# Altium schematic sheet Clk_recovery.SchDoc: =ProjectName
size 420 x 297 mm; Author: T.P.; CompanyName: WUT; DrawnBy: T.P.; Organization: WUT ISE; Address1: Warsaw Univeristy of Technology; Address2: Nowowiejska 15/19; DocumentNumber: 15; Revision: 0.9; SheetNumber: 15; SheetTotal: 36; EDA_Number: ARTIQ; Projet: ARTIQ/SINARA; ModifiedBy: -; CreateDate: XX/XX/XXXX; CheckedDate: -; Title2: Clk_recovery.SchDoc; DivGrp: ISE; Designer: G.K. and T.P.; ModifiedDate: -; ProjectName: ADC/DAC MEZZANINE
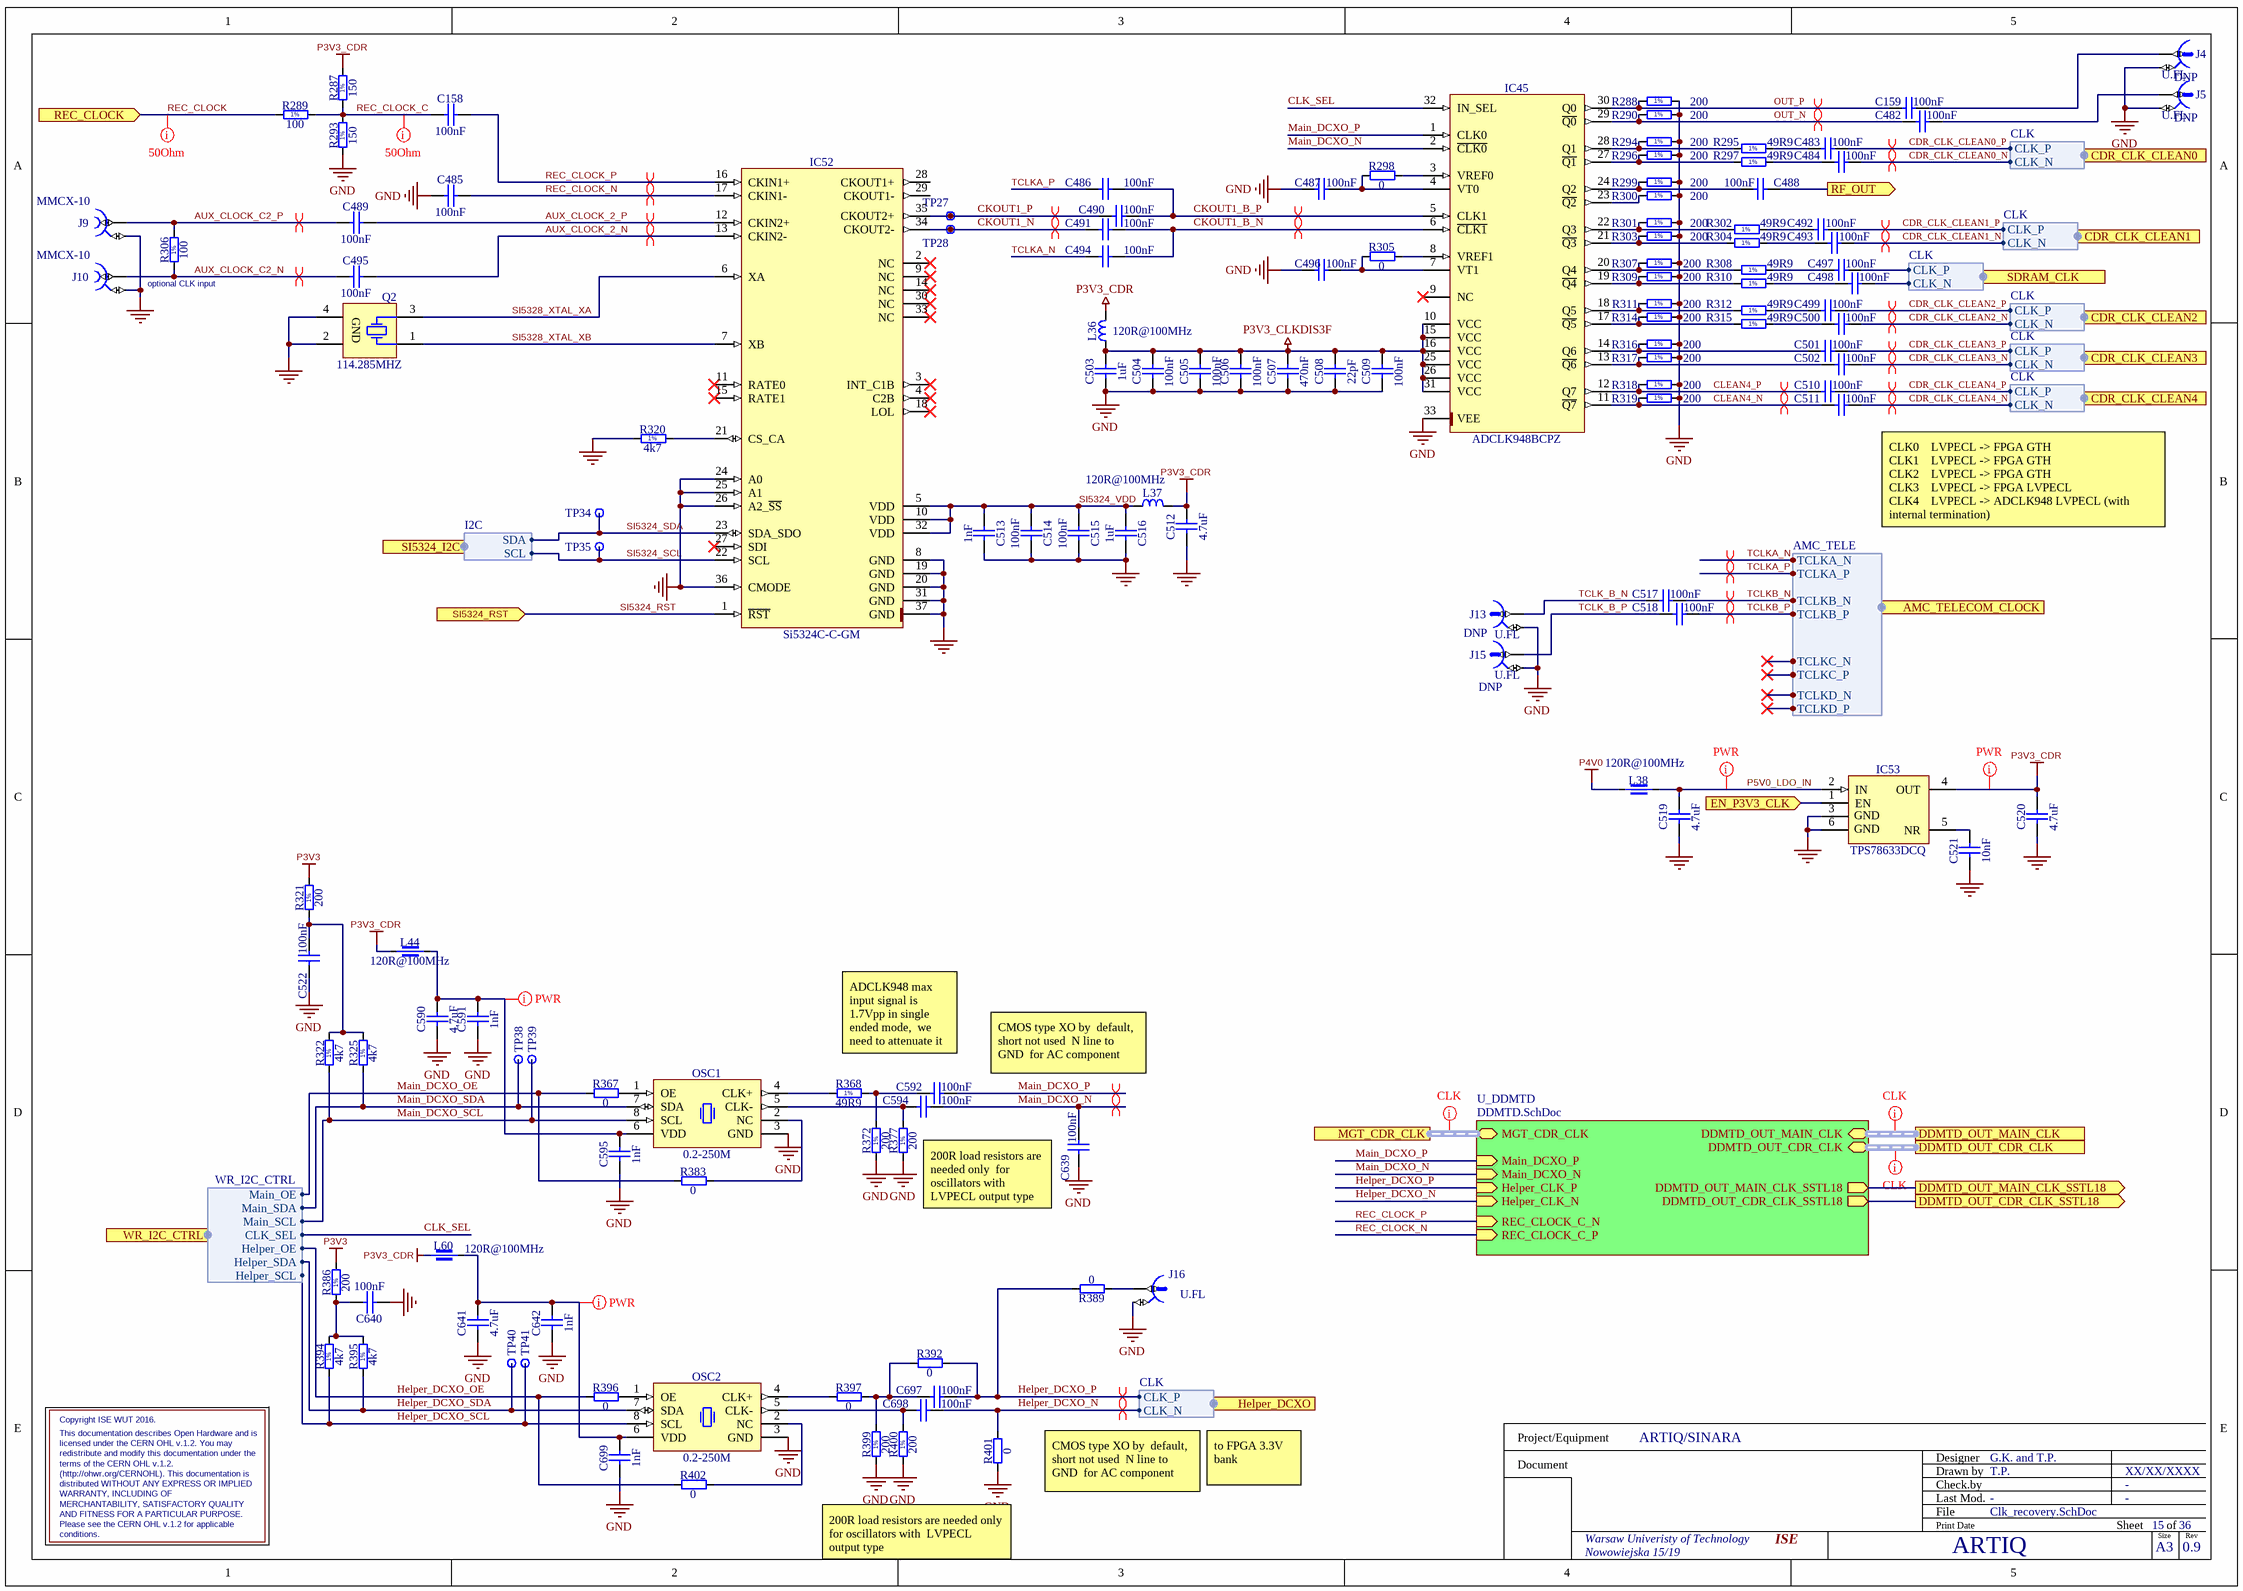
[diagram p0: Clk_recovery.SchDoc]

## Parts
C158  100nF  [CAPC0603X33N]
C159  100nF  [CAPC0603X33N]
C482  100nF  [CAPC0603X33N]
C483  100nF  [CAPC0603X33N]
C484  100nF  [CAPC0603X33N]
C485  100nF  [CAPC0603X33N]
C486  100nF  [CAPC0603X33N]
C487  100nF  [CAPC0603X33N]
C488  100nF  [CAPC0603X33N]
C489  100nF  [CAPC0603X33N]
C490  100nF  [CAPC0603X33N]
C491  100nF  [CAPC0603X33N]
C492  100nF  [CAPC0603X33N]
C493  100nF  [CAPC0603X33N]
C494  100nF  [CAPC0603X33N]
C495  100nF  [CAPC0603X33N]
C496  100nF  [CAPC0603X33N]
C497  100nF  [CAPC0603X33N]
C498  100nF  [CAPC0603X33N]
C499  100nF  [CAPC0603X33N]
C500  100nF  [CAPC0603X33N]
C501  100nF  [CAPC0603X33N]
C502  100nF  [CAPC0603X33N]
C503  1uF  [CAPC1005X55N]
C504  100nF  [CAPC0603X33N]
C505  100nF  [CAPC0603X33N]
C506  100nF  [CAPC0603X33N]
C507  470nF  [CAPC1005X55N]
C508  22pF  [CAPC1005X55N]
C509  100nF  [CAPC0603X33N]
C510  100nF  [CAPC0603X33N]
C511  100nF  [CAPC0603X33N]
C512  4.7uF  [CAPC1608X90N]
C513  1nF  [CAPC0603X33N]
C514  100nF  [CAPC0603X33N]
C515  100nF  [CAPC0603X33N]
C516  1uF  [CAPC1005X55N]
C517  100nF  [CAPC0603X33N]
C518  100nF  [CAPC0603X33N]
C519  4.7uF  [CAPC1608X90N]
C520  4.7uF  [CAPC1608X90N]
C521  10nF  [CAPC1608X87N]
C522  100nF  [CAPC0603X33N]
C590  4.7uF  [CAPC1608X90N]
C591  1nF  [CAPC0603X33N]
C592  100nF  [CAPC0603X33N]
C594  100nF  [CAPC0603X33N]
C595  1nF  [CAPC0603X33N]
C639  100nF  [CAPC0603X33N]
C640  100nF  [CAPC0603X33N]
C641  4.7uF  [CAPC1608X90N]
C642  1nF  [CAPC0603X33N]
C697  100nF  [CAPC0603X33N]
C698  100nF  [CAPC0603X33N]
C699  1nF  [CAPC0603X33N]
IC45  ADCLK948BCPZ  [QFN50P500X500X80-33N-S285]
IC52  Si5324C-C-GM  [QFN50P600X600X90-37N-S425]
IC53  TPS78633DCQ  [SOT127P700X180-6N]
J4  U.FL  value DNP  [HIROSE_U.FL-R-SMT-1(10)]
J5  U.FL  value DNP  [HIROSE_U.FL-R-SMT-1(10)]
J9  Part Number: MMCX-10  [NINIGI_MMCX-10]  (hidden comment: Coax_1Female_1Shield)
J10  Part Number: MMCX-10  [NINIGI_MMCX-10]  (hidden comment: Coax_1Female_1Shield)
J13  U.FL  value DNP  [HIROSE_U.FL-R-SMT-1(10)]
J15  U.FL  value DNP  [HIROSE_U.FL-R-SMT-1(10)]
J16  U.FL  [HIROSE_U.FL-R-SMT-1(10)]
L36  120R@100MHz  [INDC1608X95N]
L37  120R@100MHz  [INDC1608X95N]
L38  120R@100MHz  [INDC1608X95N]
L44  120R@100MHz  [INDC1608X95N]
L60  120R@100MHz  [INDC1608X95N]
OSC1  0.2-250M  [OSC_SILICON-LAB_SI570]
OSC2  0.2-250M  [OSC_SILICON-LAB_SI570]
Q2  114.285MHZ  [XTAL_CONNOR_CS]
R287  150  [RESC1005X40N]
R288  200  [RESC1005X40N]
R289  100  [RESC1005X40N]
R290  200  [RESC1005X40N]
R293  150  [RESC1005X40N]
R294  200  [RESC1005X40N]
R295  49R9  [RESC1005X40N]
R296  200  [RESC1005X40N]
R297  49R9  [RESC1005X40N]
R298  0  [RESC1005X40N]
R299  200  [RESC1005X40N]
R300  200  [RESC1005X40N]
R301  200  [RESC1005X40N]
R302  49R9  [RESC1005X40N]
R303  200  [RESC1005X40N]
R304  49R9  [RESC1005X40N]
R305  0  [RESC1005X40N]
R306  100  [RESC1005X40N]
R307  200  [RESC1005X40N]
R308  49R9  [RESC1005X40N]
R309  200  [RESC1005X40N]
R310  49R9  [RESC1005X40N]
R311  200  [RESC1005X40N]
R312  49R9  [RESC1005X40N]
R314  200  [RESC1005X40N]
R315  49R9  [RESC1005X40N]
R316  200  [RESC1005X40N]
R317  200  [RESC1005X40N]
R318  200  [RESC1005X40N]
R319  200  [RESC1005X40N]
R320  4k7  [RESC1005X40N]
R321  200  [RESC1005X40N]
R322  4k7  [RESC1005X40N]
R325  4k7  [RESC1005X40N]
R367  0  [RESC1005X40N]
R368  49R9  [RESC1005X40N]
R372  200  [RESC1005X40N]
R377  200  [RESC1005X40N]
R383  0  [RESC1005X40N]
R386  200  [RESC1005X40N]
R389  0  [RESC1005X40N]
R392  0  [RESC1005X40N]
R394  4k7  [RESC1005X40N]
R395  4k7  [RESC1005X40N]
R396  0  [RESC1005X40N]
R397  0  [RESC1005X40N]
R399  200  [RESC1005X40N]
R400  200  [RESC1005X40N]
R401  0  [RESC1005X40N]
R402  0  [RESC1005X40N]
TP27  Test Point  [TPS127]  (value not drawn)
TP28  Test Point  [TPS127]  (value not drawn)
TP34  Test Point  [TPS127]  (value not drawn)
TP35  Test Point  [TPS127]  (value not drawn)
TP38  Test Point  [TPS127]  (value not drawn)
TP39  Test Point  [TPS127]  (value not drawn)
TP40  Test Point  [TPS127]  (value not drawn)
TP41  Test Point  [TPS127]  (value not drawn)

## Sub-sheets
U_DDMTD = DDMTD.SchDoc: MGT_CDR_CLK (bidir, harness CLK), DDMTD_OUT_CDR_CLK (bidir, harness CLK), DDMTD_OUT_MAIN_CLK (bidir, harness CLK), Main_DCXO_P (in), Main_DCXO_N (in), Helper_CLK_P (in), Helper_CLK_N (in), REC_CLOCK_C_N (in), REC_CLOCK_C_P (in), DDMTD_OUT_CDR_CLK_SSTL18 (out), DDMTD_OUT_MAIN_CLK_SSTL18 (out)

## Ports
AMC_TELECOM_CLOCK (harness AMC_TELE), CDR_CLK_CLEAN0 (harness CLK), CDR_CLK_CLEAN1 (harness CLK), CDR_CLK_CLEAN2 (harness CLK), CDR_CLK_CLEAN3 (harness CLK), CDR_CLK_CLEAN4 (harness CLK), DDMTD_OUT_CDR_CLK (harness CLK), DDMTD_OUT_CDR_CLK_SSTL18 (out), DDMTD_OUT_MAIN_CLK (harness CLK), DDMTD_OUT_MAIN_CLK_SSTL18 (out), EN_P3V3_CLK (in), Helper_DCXO (harness CLK), MGT_CDR_CLK (harness CLK), REC_CLOCK (in), RF_OUT (out), SDRAM_CLK (harness CLK), SI5324_I2C (harness I2C), SI5324_RST (in), WR_I2C_CTRL (harness WR_I2C_CTRL)

## Harnesses
I2C: SCL, SDA
CLK: CLK_N, CLK_P
WR_I2C_CTRL: Main_OE, Main_SDA, Main_SCL, Helper_OE, Helper_SDA, Helper_SCL, CLK_SEL
AMC_TELE: TCLKA_N, TCLKA_P, TCLKB_N, TCLKB_P, TCLKC_N, TCLKC_P, TCLKD_N, TCLKD_P

## Nets
GND: C485.2 C487.1 C496.1 C503.1 C504.1 C505.1 C506.1 C507.1 C508.1 C509.1 C512.1 C513.1 C514.1 C515.1 C516.2 C519.1 C520.1 C521.1 C522.1 C590.1 C591.1 C595.1 C639.1 C640.1 C641.1 C642.1 C699.1 IC45.33(VEE) IC52.8(GND) IC52.19(GND) IC52.20(GND) IC52.24(A0) IC52.25(A1) IC52.26(A2_~{SS}) IC52.31(GND) IC52.36(CMODE) IC52.37(GND) IC53.3(GND) IC53.6(GND) J4.2 J5.2 J9.2 J10.2 J13.2 J15.2 J16.2 OSC1.3(GND) OSC2.3(GND) Q2.2(GND) Q2.4(GND) R288.2 R290.2 R293.1 R294.2 R296.2 R299.2 R300.2 R301.2 R303.2 R307.2 R309.2 R311.2 R314.2 R316.2 R317.2 R318.2 R319.2 R320.1 R372.1 R377.1 R399.1 R400.1 R401.1
P3V3: R321.2 R386.2
P3V3_CDR: C512.2 C520.2 IC53.4(OUT) L36.2 L37.1 L44.1 L60.1 R287.2
P3V3_CLKDIS3F: C503.2 C504.2 C505.2 C506.2 C507.2 C508.2 C509.2 IC45.10(VCC) IC45.15(VCC) IC45.16(VCC) IC45.25(VCC) IC45.26(VCC) IC45.31(VCC) L36.1
P4V0: L38.1
AUX_CLOCK_2_N: C495.1 IC52.13(CKIN2-)
AUX_CLOCK_2_P: C489.1 IC52.12(CKIN2+)
AUX_CLOCK_C2_N: C495.2 J10.1 R306.1
AUX_CLOCK_C2_P: C489.2 J9.1 R306.2
CDR_CLK_CLEAN0_N: C484.1 ; port CDR_CLK_CLEAN0.CLK_N
CDR_CLK_CLEAN0_P: C483.1 ; port CDR_CLK_CLEAN0.CLK_P
CDR_CLK_CLEAN1_N: C493.1 ; port CDR_CLK_CLEAN1.CLK_N
CDR_CLK_CLEAN1_P: C492.1 ; port CDR_CLK_CLEAN1.CLK_P
CDR_CLK_CLEAN2_N: C500.1 ; port CDR_CLK_CLEAN2.CLK_N
CDR_CLK_CLEAN2_P: C499.1 ; port CDR_CLK_CLEAN2.CLK_P
CDR_CLK_CLEAN3_N: C502.1 ; port CDR_CLK_CLEAN3.CLK_N
CDR_CLK_CLEAN3_P: C501.1 ; port CDR_CLK_CLEAN3.CLK_P
CDR_CLK_CLEAN4_N: C511.1 ; port CDR_CLK_CLEAN4.CLK_N
CDR_CLK_CLEAN4_P: C510.1 ; port CDR_CLK_CLEAN4.CLK_P
CKOUT1_B_N: C491.2 C494.2 IC45.6(~{CLK1})
CKOUT1_B_P: C486.2 C490.2 IC45.5(CLK1)
CKOUT1_N: C491.1 IC52.34(CKOUT2-) TP28.1
CKOUT1_P: C490.1 IC52.35(CKOUT2+) TP27.1
CLEAN4_N: C511.2 IC45.11(~{Q7}) R319.1
CLEAN4_P: C510.2 IC45.12(Q7) R318.1
CLK_SEL: IC45.32(IN_SEL) ; port WR_I2C_CTRL.CLK_SEL
DDMTD_OUT_CDR_CLK_SSTL18: port DDMTD_OUT_CDR_CLK_SSTL18, sheet U_DDMTD/DDMTD_OUT_CDR_CLK_SSTL18
DDMTD_OUT_MAIN_CLK_SSTL18: port DDMTD_OUT_MAIN_CLK_SSTL18, sheet U_DDMTD/DDMTD_OUT_MAIN_CLK_SSTL18
EN_P3V3_CLK: IC53.1(EN) ; port EN_P3V3_CLK
Helper_DCXO_N: C698.2 R401.2 ; sheet U_DDMTD/Helper_CLK_N, port Helper_DCXO.CLK_N
Helper_DCXO_OE: R396.1 R402.1 ; port WR_I2C_CTRL.Helper_OE
Helper_DCXO_P: C697.2 R389.2 R392.2 ; sheet U_DDMTD/Helper_CLK_P, port Helper_DCXO.CLK_P
Helper_DCXO_SCL: OSC2.8(SCL) R394.1 TP41.1 ; port WR_I2C_CTRL.Helper_SCL
Helper_DCXO_SDA: OSC2.7(SDA) R395.1 TP40.1 ; port WR_I2C_CTRL.Helper_SDA
Main_DCXO_N: C594.2 C639.2 IC45.2(~{CLK0}) ; sheet U_DDMTD/Main_DCXO_N
Main_DCXO_OE: R367.1 R383.1 ; port WR_I2C_CTRL.Main_OE
Main_DCXO_P: C592.2 IC45.1(CLK0) ; sheet U_DDMTD/Main_DCXO_P
Main_DCXO_SCL: OSC1.8(SCL) R322.1 TP39.1 ; port WR_I2C_CTRL.Main_SCL
Main_DCXO_SDA: OSC1.7(SDA) R325.1 TP38.1 ; port WR_I2C_CTRL.Main_SDA
OUT_N: C482.2 IC45.29(~{Q0}) R290.1
OUT_P: C159.2 IC45.30(Q0) R288.1
P5V0_LDO_IN: C519.2 IC53.2(IN) L38.2
REC_CLOCK: R289.1 ; port REC_CLOCK
REC_CLOCK_C: C158.2 R287.1 R289.2 R293.2
REC_CLOCK_N: C485.1 IC52.17(CKIN1-) ; sheet U_DDMTD/REC_CLOCK_C_P
REC_CLOCK_P: C158.1 IC52.16(CKIN1+) ; sheet U_DDMTD/REC_CLOCK_C_N
RF_OUT: C488.2 ; port RF_OUT
SI5324_RST: IC52.1(~{RST}) ; port SI5324_RST
SI5324_SCL: IC52.22(SCL) TP35.1 ; port SI5324_I2C.SCL
SI5324_SDA: IC52.23(SDA_SDO) TP34.1 ; port SI5324_I2C.SDA
SI5324_VDD: C513.2 C514.2 C515.2 C516.1 IC52.5(VDD) IC52.10(VDD) IC52.32(VDD) L37.2
SI5328_XTAL_XA: IC52.6(XA) Q2.3(X)
SI5328_XTAL_XB: IC52.7(XB) Q2.1(X)
TCLK_B_N: C517.2 J13.1
TCLK_B_P: C518.2 J15.1
TCLKA_N: C494.1 ; port AMC_TELECOM_CLOCK.TCLKA_N
TCLKA_P: C486.1 ; port AMC_TELECOM_CLOCK.TCLKA_P
TCLKB_N: C517.1 ; port AMC_TELECOM_CLOCK.TCLKB_N
TCLKB_P: C518.1 ; port AMC_TELECOM_CLOCK.TCLKB_P
NetC159_1: C159.1 J4.1
NetC482_1: C482.1 J5.1
NetC483_2: C483.2 R295.2
NetC484_2: C484.2 R297.2
NetC487_2: C487.2 IC45.4(VT0) R298.1
NetC488_1: C488.1 IC45.24(Q2) R299.1
NetC492_2: C492.2 R302.2
NetC493_2: C493.2 R304.2
NetC496_2: C496.2 IC45.7(VT1) R305.1
NetC497_1: C497.1 ; port SDRAM_CLK.CLK_P
NetC497_2: C497.2 R308.2
NetC498_1: C498.1 ; port SDRAM_CLK.CLK_N
NetC498_2: C498.2 R310.2
NetC499_2: C499.2 R312.2
NetC500_2: C500.2 R315.2
NetC501_2: C501.2 IC45.14(Q6) R316.1
NetC502_2: C502.2 IC45.13(~{Q6}) R317.1
NetC521_2: C521.2 IC53.5(NR)
NetC522_2: C522.2 R321.1 R322.2 R325.2
NetC590_2: C590.2 C591.2 C595.2 L44.2 OSC1.6(VDD)
NetC592_1: C592.1 R368.2 R372.2
NetC594_1: C594.1 OSC1.5(CLK-) R377.2
NetC640_2: C640.2 R386.1 R394.2 R395.2
NetC641_2: C641.2 C642.2 C699.2 L60.2 OSC2.6(VDD)
NetC697_1: C697.1 R392.1 R397.2 R399.2
NetC698_1: C698.1 OSC2.5(CLK-) R400.2
NetIC45_3: IC45.3(VREF0) R298.2
NetIC45_8: IC45.8(VREF1) R305.2
NetIC45_17: IC45.17(~{Q5}) R314.1 R315.1
NetIC45_18: IC45.18(Q5) R311.1 R312.1
NetIC45_19: IC45.19(~{Q4}) R309.1 R310.1
NetIC45_20: IC45.20(Q4) R307.1 R308.1
NetIC45_21: IC45.21(~{Q3}) R303.1 R304.1
NetIC45_22: IC45.22(Q3) R301.1 R302.1
NetIC45_23: IC45.23(~{Q2}) R300.1
NetIC45_27: IC45.27(~{Q1}) R296.1 R297.1
NetIC45_28: IC45.28(Q1) R294.1 R295.1
NetIC52_21: IC52.21(CS_CA) R320.2
NetJ16_1: J16.1 R389.1
NetOSC1_1: OSC1.1(OE) R367.2
NetOSC1_2: OSC1.2(NC) R383.2
NetOSC1_4: OSC1.4(CLK+) R368.1
NetOSC2_1: OSC2.1(OE) R396.2
NetOSC2_2: OSC2.2(NC) R402.2
NetOSC2_4: OSC2.4(CLK+) R397.1

Not connected (* = marked no-connect by the designer): IC45 9(NC)*; IC52 2(NC)* 3(INT_C1B)* 4(C2B)* 9(NC)* 11(RATE0)* 14(NC)* 15(RATE1)* 18(LOL)* 27(SDI)* 28(CKOUT1+) 29(CKOUT1-) 30(NC)* 33(NC)*

## Buses and harness runs
harness port DDMTD_OUT_CDR_CLK = sheet U_DDMTD/DDMTD_OUT_CDR_CLK
harness port DDMTD_OUT_MAIN_CLK = sheet U_DDMTD/DDMTD_OUT_MAIN_CLK
harness port MGT_CDR_CLK = sheet U_DDMTD/MGT_CDR_CLK

## Layout directives
differential pair; differential pair class Diff_100Ohm: AUX_CLOCK_2_N, AUX_CLOCK_2_P, AUX_CLOCK_C2_N, AUX_CLOCK_C2_P, CKOUT1_B_N, CKOUT1_B_P, CKOUT1_N, CKOUT1_P, Helper_DCXO_N, Helper_DCXO_P, Main_DCXO_N, Main_DCXO_P, REC_CLOCK_N, REC_CLOCK_P, TCLKA_N, TCLKA_P, TCLKB_N, TCLKB_P
differential pair; differential pair class LVPECL: CDR_CLK_CLEAN0_N, CDR_CLK_CLEAN0_P, CDR_CLK_CLEAN1_N, CDR_CLK_CLEAN1_P, CDR_CLK_CLEAN2_N, CDR_CLK_CLEAN2_P, CDR_CLK_CLEAN3_N, CDR_CLK_CLEAN3_P, CDR_CLK_CLEAN4_N, CDR_CLK_CLEAN4_P, CLEAN4_N, CLEAN4_P, OUT_N, OUT_P
mark named 50Ohm: REC_CLOCK, REC_CLOCK_C
net class PWR: NetC590_2, NetC641_2, P3V3_CDR, P5V0_LDO_IN
net class CLK: (no net found under the mark)

## Notes on the sheet
- (near R306) optional CLK input
- CLK0    LVPECL -> FPGA GTH
  CLK1    LVPECL -> FPGA GTH
  CLK2    LVPECL -> FPGA GTH
  CLK3    LVPECL -> FPGA LVPECL
  CLK4    LVPECL -> ADCLK948 LVPECL (with internal termination)
- ADCLK948 max input signal is 1.7Vpp in single  ended mode,  we need to attenuate it
- CMOS type XO by  default, short not used  N line to GND  for AC component
- 200R load resistors are needed only  for oscillators with  LVPECL output type
- Copyright ISE WUT 2016.
- (http://ohwr.org/CERNOHL). This documentation is
- terms of the CERN OHL v.1.2.
- redistribute and modify this documentation under the
- distributed WITHOUT ANY EXPRESS OR IMPLIED
- This documentation describes Open Hardware and is
- licensed under the CERN OHL v.1.2. You may
- to FPGA 3.3V bank
- MERCHANTABILITY, SATISFACTORY QUALITY
- conditions.
- AND FITNESS FOR A PARTICULAR PURPOSE.
- Please see the CERN OHL v.1.2 for applicable
- WARRANTY, INCLUDING OF
- (near R401) CMOS type XO by  default, short not used  N line to GND  for AC component
- Project/Equipment
- Document
- Designer
- Drawn by
- Check.by
- File
- Last Mod.
- Print Date
- Sheet
- Size
- A3
- of
- Rev
- (in symbol R0402_4K7_1%_0.0625W_100PPM) 1%
- (in symbol R0402_49R9_1%_0.0625W_100PPM) 1%
- (in symbol R0402_100R_1%_0.0625W_100PPM) 1%
- (in symbol R0402_150R_1%_0.0625W_100PPM) 1%
- (in symbol R0402_200R_1%_0.0625W_100PPM) 1%

## Library data of the parts
C158 C159 C482-C485 C488 C489 C492 C493 C495 C497-C502 C510 C511 C514 C515 C517 C518 C640 = CC0201_100NF_6.3V_10%_X5R: Non-polarised capacitor; Manufacturer: GENERIC; Part Description: SMD Multilayer Chip Ceramic Capacitor; Manufacturer1 Part Number: 02016D104KAT2A; Tolerance: ±10%; Voltage: 6.3V; TC: X5R; Manufacturer Part Number: CC0201_100NF_6.3V_10%_X5R; Part Number: CC0201_100NF_6.3V_10%_X5R; Value: 100nF; Component Kind: Standard; Component Type: Standard; Pin Count: 2; Status: Not Recommended; Case: 0201; Mounted: Yes; Socket: No; SMD: Yes; Sense: No; Manufacturer1 Example: AVX; Manufacturer1 ComponentHeight: 0.33mm; HelpURL: \\cern.ch\dfs\Applications\Altium\Datasheets\CC0201_X5R_AVX.pdf; Author: CERN DEM JLC; CreateDate: 03.12.2007; LatestRevisionDate: 03.12.2007
C486 C487 C490 C491 C494 C496 C504-C506 C509 C522 C592 C594 C639 C697 C698 = CC0201_100NF_6.3V_10%_X5R: Non-polarised capacitor; Part Description: SMD Multilayer Chip Ceramic Capacitor; Manufacturer: GENERIC; Manufacturer1 Part Number: 02016D104KAT2A; Voltage: 6.3V; TC: X5R; Tolerance: ±10%; Part Number: CC0201_100NF_6.3V_10%_X5R; Component Kind: Standard; Component Type: Standard; Pin Count: 2; Value: 100nF; Status: Not Recommended; Manufacturer Part Number: CC0201_100NF_6.3V_10%_X5R; Case: 0201; Mounted: Yes; Socket: No; SMD: Yes; Sense: No; Manufacturer1 Example: AVX; Manufacturer1 ComponentHeight: 0.33mm; HelpURL: \\cern.ch\dfs\Applications\Altium\Datasheets\CC0201_X5R_AVX.pdf; Author: CERN DEM JLC; CreateDate: 03.12.2007; LatestRevisionDate: 03.12.2007
C503 = CC0402_1UF_16V_10%_X5R: Non-polarised capacitor; Part Description: SMD Multilayer Chip Ceramic Capacitor; Manufacturer: GENERIC; Manufacturer1 Part Number: C1005X5R1C105KT; Voltage: 16V; TC: X5R; Tolerance: ±10%; Part Number: CC0402_1UF_16V_10%_X5R; Component Kind: Standard; Component Type: Standard; Pin Count: 2; Value: 1uF; Status: Preferred; Manufacturer Part Number: CC0402_1UF_16V_10%_X5R; Case: 0402; Mounted: Yes; Socket: No; SMD: Yes; Sense: No; Manufacturer1 Example: TDK; Manufacturer1 ComponentHeight: 0.55mm; HelpURL: \\cern.ch\dfs\Applications\Altium\Datasheets\CC0402_X5R_TDK_C.pdf; Author: CERN DEM JLC; CreateDate: 25.10.2012; LatestRevisionDate: 25.10.2012
C507 = CC0402_470NF_16V_10%_X5R: Non-polarised capacitor; Part Description: SMD Multilayer Chip Ceramic Capacitor; Manufacturer: GENERIC; Manufacturer1 Part Number: C1005X5R1C105KT; Voltage: 16V; TC: X5R; Tolerance: ±10%; Part Number: CC0402_470NF_16V_10%_X5R; Component Kind: Standard; Component Type: Standard; Pin Count: 2; Value: 470nF; Status: Preferred; Manufacturer Part Number: CC0402_470NF_16V_10%_X5R; Case: 0402; Mounted: Yes; Socket: No; SMD: Yes; Sense: No; Manufacturer1 Example: TDK; Manufacturer1 ComponentHeight: 0.55mm; HelpURL: \\cern.ch\dfs\Applications\Altium\Datasheets\CC0402_X5R_TDK_C.pdf; Author: CERN DEM JLC; CreateDate: 25.10.2012; LatestRevisionDate: 25.10.2012
C508 = CC0402_22PF_50V_5%_C0G: Non-polarised capacitor; Part Description: SMD Multilayer Chip Ceramic Capacitor; Manufacturer: GENERIC; Manufacturer1 Part Number: C0402C220J5GACTU; Voltage: 50V; TC: C0G/NP0; Tolerance: ±5%; Part Number: CC0402_22PF_50V_5%_C0G; Component Kind: Standard; Component Type: Standard; Pin Count: 2; Value: 22pF; Status: Preferred; Manufacturer Part Number: CC0402_22PF_50V_5%_C0G; Case: 0402; Mounted: Yes; Socket: No; SMD: Yes; Sense: No; Manufacturer1 Example: KEMET; Manufacturer1 ComponentHeight: 0.55mm; HelpURL: \\cern.ch\dfs\Applications\Altium\Datasheets\CC0805_C0G_KEMET_(Commercial Grade).pdf; Author: CERN DEM JLC; CreateDate: 03.12.2007; LatestRevisionDate: 03.12.2007
C512 C519 C520 = CC0603_4.7UF_25V_10%_X5R: Non-polarised capacitor; Manufacturer: GENERIC; Part Description: SMD Multilayer Chip Ceramic Capacitor; Manufacturer1 Part Number: GRM188R61E475KE11D; Tolerance: ±10%; Voltage: 25V; TC: X5R; Manufacturer Part Number: CC0603_4.7UF_25V_10%_X5R; Part Number: CC0603_4.7UF_25V_10%_X5R; Value: 4.7uF; Component Kind: Standard; Component Type: Standard; Pin Count: 2; Status: None; Case: 0603; Mounted: Yes; Socket: No; SMD: Yes; Sense: No; Manufacturer1 Example: MURATA; Manufacturer1 ComponentHeight: 0.95mm; HelpURL: \\cern.ch\dfs\Applications\Altium\Datasheets\CC0603_MURATA_GRM188R61E475KE11D.pdf; Author: CERN DEM JLC; CreateDate: 10.11.2014; LatestRevisionDate: 10.11.2014
C513 = CC0201_1NF_16V_10%_X5R: Non-polarised capacitor; Manufacturer: GENERIC; Part Description: SMD Multilayer Chip Ceramic Capacitor; Manufacturer1 Part Number: 0201YD102KAT2A; Tolerance: ±10%; Voltage: 16V; TC: X5R; Manufacturer Part Number: CC0201_1NF_16V_10%_X5R; Part Number: CC0201_1NF_16V_10%_X5R; Value: 1nF; Component Kind: Standard; Component Type: Standard; Pin Count: 2; Status: Not Recommended; Case: 0201; Mounted: Yes; Socket: No; SMD: Yes; Sense: No; Manufacturer1 Example: AVX; Manufacturer1 ComponentHeight: 0.33mm; HelpURL: \\cern.ch\dfs\Applications\Altium\Datasheets\CC0201_X5R_AVX.pdf; Author: CERN DEM JLC; CreateDate: 03.12.2007; LatestRevisionDate: 03.12.2007
C516 = CC0402_1UF_16V_10%_X5R: Non-polarised capacitor; Manufacturer: GENERIC; Part Description: SMD Multilayer Chip Ceramic Capacitor; Manufacturer1 Part Number: C1005X5R1C105KT; Tolerance: ±10%; Voltage: 16V; TC: X5R; Manufacturer Part Number: CC0402_1UF_16V_10%_X5R; Part Number: CC0402_1UF_16V_10%_X5R; Value: 1uF; Component Kind: Standard; Component Type: Standard; Pin Count: 2; Status: Preferred; Case: 0402; Mounted: Yes; Socket: No; SMD: Yes; Sense: No; Manufacturer1 Example: TDK; Manufacturer1 ComponentHeight: 0.55mm; HelpURL: \\cern.ch\dfs\Applications\Altium\Datasheets\CC0402_X5R_TDK_C.pdf; Author: CERN DEM JLC; CreateDate: 25.10.2012; LatestRevisionDate: 25.10.2012
C521 = CC0603_10NF_50V_5%_C0G: Non-polarised capacitor; Part Description: SMD Multilayer Chip Ceramic Capacitor; Manufacturer: GENERIC; Manufacturer1 Part Number: C1608C0G1H103J080AA; Voltage: 50V; TC: C0G/NP0; Tolerance: ±5%; Part Number: CC0603_10NF_50V_5%_C0G; Component Kind: Standard; Component Type: Standard; Pin Count: 2; Value: 10nF; Status: Preferred; Manufacturer Part Number: CC0603_10NF_50V_5%_C0G; Case: 0603; Mounted: Yes; Socket: No; SMD: Yes; Sense: No; Manufacturer1 Example: TDK; Manufacturer1 ComponentHeight: 0.9mm; HelpURL: \\cern.ch\dfs\Applications\Altium\Datasheets\CC0603_C0G_TDK_C.pdf; Author: CERN DEM JLC; CreateDate: 10.12.2014; LatestRevisionDate: 10.12.2014
C590 C641 = CC0603_4.7UF_25V_10%_X5R: Non-polarised capacitor; Part Description: SMD Multilayer Chip Ceramic Capacitor; Manufacturer: GENERIC; Manufacturer1 Part Number: GRM188R61E475KE11D; Voltage: 25V; TC: X5R; Tolerance: ±10%; Part Number: CC0603_4.7UF_25V_10%_X5R; Component Kind: Standard; Component Type: Standard; Pin Count: 2; Value: 4.7uF; Status: None; Manufacturer Part Number: CC0603_4.7UF_25V_10%_X5R; Case: 0603; Mounted: Yes; Socket: No; SMD: Yes; Sense: No; Manufacturer1 Example: MURATA; Manufacturer1 ComponentHeight: 0.95mm; HelpURL: \\cern.ch\dfs\Applications\Altium\Datasheets\CC0603_MURATA_GRM188R61E475KE11D.pdf; Author: CERN DEM JLC; CreateDate: 10.11.2014; LatestRevisionDate: 10.11.2014
C591 C595 C642 C699 = CC0201_1NF_16V_10%_X5R: Non-polarised capacitor; Part Description: SMD Multilayer Chip Ceramic Capacitor; Manufacturer: GENERIC; Manufacturer1 Part Number: 0201YD102KAT2A; Voltage: 16V; TC: X5R; Tolerance: ±10%; Part Number: CC0201_1NF_16V_10%_X5R; Component Kind: Standard; Component Type: Standard; Pin Count: 2; Value: 1nF; Status: Not Recommended; Manufacturer Part Number: CC0201_1NF_16V_10%_X5R; Case: 0201; Mounted: Yes; Socket: No; SMD: Yes; Sense: No; Manufacturer1 Example: AVX; Manufacturer1 ComponentHeight: 0.33mm; HelpURL: \\cern.ch\dfs\Applications\Altium\Datasheets\CC0201_X5R_AVX.pdf; Author: CERN DEM JLC; CreateDate: 03.12.2007; LatestRevisionDate: 03.12.2007
IC45 = ADCLK948BCPZ: Two Selectable Inputs, 8 LVPECL Outputs, SiGe Clock Fanout Buffer; Manufacturer: ANALOG DEVICES; PressFit: No; Bonding: No; Part Number: ADCLK948BCPZ; Component Kind: Standard; Component Type: Standard; Device: ADCLK948BCPZ; PackageDescription: QFN, 0.50mm Pitch, Square; 8 Pin X 8 Pin, 5mm X 5mm X 1.00mm H body (w/thermal tab 2.85 X 2.85mm),  IPC Medium Density; Part Description: Two Selectable Inputs, 8 LVPECL Outputs, SiGe Clock Fanout Buffer; Manufacturer Part Number: ADCLK948BCPZ; Pin Count: 33; Case: QFN32; Mounted: Yes; Socket: No; SMD: Yes; Sense: No; ComponentHeight: 0.8mm; Author: CERN DEM MR; HelpURL: \\cern.ch\dfs\Applications\Altium\Datasheets\ADCLK948BCPZ.pdf; CreateDate: 30.11.2016; LatestRevisionDate: 30.11.2016
IC52 = Si5324C-C-GM: Any Frequency Precision Clock Multiplier/Jitter Attenuator; Manufacturer: SILICON LABS; PressFit: No; Bonding: No; Manufacturer Part Number: Si5324C-C-GM; PackageDescription: QFN, 0.50mm Pitch, Square; 36 Pin, 6.00mm L X 6.00mm W X 0.90mm H Body (w/thermal tab 4.25mm x 4.25mm), IPC Medium Density; Part Description: Any Frequency Precision Clock Multiplier/Jitter Attenuator; Part Number: Si5324C-C-GM; Component Kind: Standard; Component Type: Standard; Device: Si5324C-C-GM; Pin Count: 37; Case: QFN36; Mounted: Yes; Socket: No; SMD: Yes; Sense: No; ComponentHeight: 0.9mm; HelpURL: \\cern.ch\dfs\Applications\Altium\Datasheets\Si5324C-C-GM.pdf; Author: CERN DEM JLC; CreateDate: 19.08.2013; LatestRevisionDate: 19.08.2013
IC53 = TPS78633DCQ: Ultralow-Noise, High-PSRR, Fast, RF, 1.5A Low-Dropout Linear Regulator; Part Description: 3.3V Ultralow-Noise, High-PSRR, Fast, RF, 1.5A Low-Dropout Linear Regulator; Manufacturer: TEXAS INSTRUMENTS; PressFit: No; Bonding: No; Part Number: TPS78633DCQ; Component Kind: Standard; Component Type: Standard; Device: TPS78633DCQ; PackageDescription: SOT223, 6-Leads, Body 6.6x7.3mm (max), Pitch 1.27mm, IPC Medium Density; Manufacturer Part Number: TPS78633DCQ; Pin Count: 6; Case: SOT223; Mounted: Yes; Socket: No; SMD: Yes; Sense: No; ComponentHeight: 1.8mm; HelpURL: \\cern.ch\dfs\Applications\Altium\Datasheets\TPS78633DCQ.pdf; Author: CERN DEM JMW; CreateDate: 07.10.2008; LatestRevisionDate: 13.02.2017
J4 J5 J13 J15 = HIROSE_U.FL-R-SMT-1(10): Part Description: Up to 6GHz Ultra Small Surface Mount Male Coaxial Connectors U.FL Series; Manufacturer: HIROSE (HRS); Mounted: No; PressFit: No; Part Number: HIROSE_U.FL-R-SMT-1(10); Component Kind: Standard; Component Type: Standard; Pin Count: 2; Family: U.FL; Socket: No; SMD: Yes; Sense: No; Status: None; Manufacturer Part Number: U.FL-R-SMT-1(10); ComponentHeight: 1.25mm; HelpURL: \\cern.ch\dfs\Applications\Altium\Datasheets\HIROSE_U.FL-R-SMT-1(10).pdf; Author: CERN DEM JLC; CreateDate: 24.03.2010; LatestRevisionDate: 24.03.2010
J9 J10 = CON_RF_MMCX: Part Description: Straight Through-hole 50 Ohm Micro Mini RF Jack, MMCX Series; Manufacturer: NINIGI; Manufacturer Part Number: NINIGI MMCX-10; PressFit: No; Component Kind: Standard; Component Type: Standard; Pin Count: 2; Mounted: Yes; Socket: No; Sense: No; SMD: No; Status: None; ComponentHeight: 4.35mm; HelpURL: \\cern.ch\dfs\Applications\Altium\Datasheets\SAMTEC_MMCX-J-P-H-ST-TH1.pdf; Author: GK; CreateDate: 05.12.2012; LatestRevisionDate: 05.12.2012
J16 = HIROSE_U.FL-R-SMT-1(10): Manufacturer: HIROSE (HRS); Part Description: Up to 6GHz Ultra Small Surface Mount Male Coaxial Connectors U.FL Series; PressFit: No; Manufacturer Part Number: U.FL-R-SMT-1(10); Part Number: HIROSE_U.FL-R-SMT-1(10); Component Kind: Standard; Component Type: Standard; Pin Count: 2; Family: U.FL; Mounted: Yes; Socket: No; SMD: Yes; Sense: No; Status: None; ComponentHeight: 1.25mm; HelpURL: \\cern.ch\dfs\Applications\Altium\Datasheets\HIROSE_U.FL-R-SMT-1(10).pdf; Author: CERN DEM JLC; CreateDate: 24.03.2010; LatestRevisionDate: 24.03.2010
L36 = IND0603_MURATA_BLM18PG121SN1D: Inductor; Part Description: SMD EMIFIL Chip Ferrite Bead; Manufacturer: MURATA; Power: 2A; Resistance: 0.05R; Part Number: IND0603_MURATA_BLM18PG121SN1D; Component Kind: Standard; Component Type: Standard; Pin Count: 2; Value: 120R@100MHz; Status: None; Manufacturer Part Number: BLM18PG121SN1D; Case: 0603; Mounted: Yes; Socket: No; SMD: Yes; Sense: No; ComponentHeight: 0.95mm; HelpURL: \\cern.ch\dfs\Applications\Altium\Datasheets\IND0603_MURATA_BLM18P.pdf; Author: CERN DEM BC; CreateDate: 27.07.2015; LatestRevisionDate: 27.07.2015
L37 = IND0603_MURATA_BLM18PG121SN1D: Inductor; Manufacturer: MURATA; Part Description: SMD EMIFIL Chip Ferrite Bead; Power: 2A; Resistance: 0.05R; Manufacturer Part Number: BLM18PG121SN1D; Part Number: IND0603_MURATA_BLM18PG121SN1D; Value: 120R@100MHz; Component Kind: Standard; Component Type: Standard; Pin Count: 2; Status: None; Case: 0603; Mounted: Yes; Socket: No; SMD: Yes; Sense: No; ComponentHeight: 0.95mm; HelpURL: \\cern.ch\dfs\Applications\Altium\Datasheets\IND0603_MURATA_BLM18P.pdf; Author: CERN DEM BC; CreateDate: 27.07.2015; LatestRevisionDate: 27.07.2015
L38 = IND0603_MURATA_BLM18PG121SN1D: Manufacturer: MURATA; Part Description: SMD EMIFIL Chip Ferrite Bead; Power: 2A; Resistance: 0.05R; Manufacturer Part Number: BLM18PG121SN1D; Part Number: IND0603_MURATA_BLM18PG121SN1D; Value: 120R@100MHz; Component Kind: Standard; Component Type: Standard; Pin Count: 2; Status: None; Case: 0603; Mounted: Yes; Socket: No; SMD: Yes; Sense: No; ComponentHeight: 0.95mm; HelpURL: \\cern.ch\dfs\Applications\Altium\Datasheets\IND0603_MURATA_BLM18P.pdf; Author: CERN DEM BC; CreateDate: 27.07.2015; LatestRevisionDate: 25.10.2018
L44 L60 = IND0603_MURATA_BLM18PG121SN1D: Part Description: SMD EMIFIL Chip Ferrite Bead; Manufacturer: MURATA; Power: 2A; Resistance: 0.05R; Part Number: IND0603_MURATA_BLM18PG121SN1D; Component Kind: Standard; Component Type: Standard; Pin Count: 2; Value: 120R@100MHz; Status: None; Manufacturer Part Number: BLM18PG121SN1D; Case: 0603; Mounted: Yes; Socket: No; SMD: Yes; Sense: No; ComponentHeight: 0.95mm; HelpURL: \\cern.ch\dfs\Applications\Altium\Datasheets\IND0603_MURATA_BLM18P.pdf; Author: CERN DEM BC; CreateDate: 27.07.2015; LatestRevisionDate: 25.10.2018
OSC1 OSC2 = 549CBAC000112ABG: Ultra Low Jitter I2C Programmable XO (95 fs), 0.2 to 250MHz; Manufacturer: Silabs; Part Name: OSC_10-280MHZ_SILICON-LAB_Si570BBC000121DG; Part Number: OSC_0.2_250M_SILICON-LAB_549CBAC000112ABG; Cell Name: OSC_SILICON-LAB_SI549; Tolerance: 25ppm; Voltage: 3V3; Case: OSC_SILICON-LAB_SI549; Device: 549CBAC000112ABG; Manufacturer Part Number: 549CBAC000112ABG; Part Description: Ultra Low Jitter I2C Programmable XO (95 fs), 0.2 to 250MHz; Value: 0.2-250M
Q2 = XTAL_114.285MHZ_CONNOR_CS-023: Crystal 4 pins 1=XTAL Control 2=GND3=XTAL 4=GND; Manufacturer Part Number: CS-023-114.285M; Manufacturer: CONNOR-WINFIELD; Part Description: ±20ppm 18pF -40°C to +85°C  4 Pins, 3.2x2.5X0.8mm, SMD Crystal Unit, CS-018 Series; PressFit: No; Bonding: No; PackageDescription: 4 Pins, 2.5x3.2mm, SMD Sealing Crystal, CS Series; Part Number: XTAL_114.285MHZ_CONNOR_CS-023; Value: 114.285MHZ; Component Kind: Standard; Component Type: Standard; Pin Count: 4; Mounted: Yes; Socket: No; SMD: Yes; Sense: No; ComponentHeight: 0.8mm; HelpURL: \\cern.ch\dfs\Applications\Altium\Datasheets\XTAL_CONNOR_CS-023.pdf; Author: CERN DEM JLC; CreateDate: 08.07.2014; LatestRevisionDate: 08.07.2014
R287 R293 = R0402_150R_1%_0.0625W_100PPM: Resistor - 1%; Part Description: General Purpose Thick Film Chip Resistor; Manufacturer: GENERIC; Manufacturer1 Part Number: 232270671501L; TC: ±100ppm/°C; PressFit: No; Part Number: R0402_150R_1%_0.0625W_100PPM; Component Kind: Standard; Component Type: Standard; Pin Count: 2; Value: 150; Status: Not Recommended; Power: 0.0625W; Tolerance: ±1%; Manufacturer Part Number: R0402_150R_1%_0.0625W_100PPM; Case: 0402; Mounted: Yes; Sense: No; Socket: No; SMD: Yes; Manufacturer1 Example: YAGEO PHYCOMP; Manufacturer1 ComponentHeight: 0.4mm; HelpURL: \\cern.ch\dfs\Applications\Altium\Datasheets\R0402_Phycomp_RC0402.pdf; Author: CERN DEM JLC; CreateDate: 03.12.2007; LatestRevisionDate: 17.10.2012
R288 R290 R294 R296 R299-R301 R303 R307 R309 R311 R314 R316-R319 = R0402_200R_1%_0.0625W_100PPM: Resistor - 1%; Manufacturer: GENERIC; Part Description: General Purpose Thick Film Chip Resistor; Manufacturer1 Part Number: 232270672001L; TC: ±100ppm/°C; PressFit: No; Manufacturer Part Number: R0402_200R_1%_0.0625W_100PPM; Part Number: R0402_200R_1%_0.0625W_100PPM; Tolerance: ±1%; Value: 200; Component Kind: Standard; Component Type: Standard; Pin Count: 2; Status: Not Recommended; Power: 0.0625W; Case: 0402; Mounted: Yes; Sense: No; Socket: No; SMD: Yes; Manufacturer1 Example: YAGEO PHYCOMP; Manufacturer1 ComponentHeight: 0.4mm; HelpURL: \\cern.ch\dfs\Applications\Altium\Datasheets\R0402_Phycomp_RC0402.pdf; Author: CERN DEM JLC; CreateDate: 03.12.2007; LatestRevisionDate: 17.10.2012
R289 R306 = R0402_100R_1%_0.0625W_100PPM: Resistor - 1%; Manufacturer: GENERIC; Part Description: General Purpose Thick Film Chip Resistor; Manufacturer1 Part Number: 232270671001L; TC: ±100ppm/°C; PressFit: No; Manufacturer Part Number: R0402_100R_1%_0.0625W_100PPM; Part Number: R0402_100R_1%_0.0625W_100PPM; Tolerance: ±1%; Value: 100; Component Kind: Standard; Component Type: Standard; Pin Count: 2; Status: Not Recommended; Power: 0.0625W; Case: 0402; Mounted: Yes; Sense: No; Socket: No; SMD: Yes; Manufacturer1 Example: YAGEO PHYCOMP; Manufacturer1 ComponentHeight: 0.4mm; HelpURL: \\cern.ch\dfs\Applications\Altium\Datasheets\R0402_Phycomp_RC0402.pdf; Author: CERN DEM JLC; CreateDate: 03.12.2007; LatestRevisionDate: 17.10.2012
R295 R297 R302 R304 R308 R310 R312 R315 R368 = R0402_49R9_1%_0.0625W_100PPM: Resistor - 1%; Manufacturer: GENERIC; Part Description: General Purpose Thick Film Chip Resistor; Manufacturer1 Part Number: 232270674999L or RC0402FR-0749R9L; TC: ±100ppm/°C; PressFit: No; Manufacturer Part Number: R0402_49R9_1%_0.0625W_100PPM; Part Number: R0402_49R9_1%_0.0625W_100PPM; Tolerance: ±1%; Value: 49R9; Component Kind: Standard; Component Type: Standard; Pin Count: 2; Status: Not Recommended; Power: 0.0625W; Case: 0402; Mounted: Yes; Sense: No; Socket: No; SMD: Yes; Manufacturer1 Example: YAGEO PHYCOMP; Manufacturer1 ComponentHeight: 0.4mm; HelpURL: \\cern.ch\dfs\Applications\Altium\Datasheets\R0402_Phycomp_RC0402.pdf; Author: CERN DEM JLC; CreateDate: 24.10.2012; LatestRevisionDate: 24.10.2012
R298 R305 R367 R383 R392 R396 R397 R401 R402 = R0402_0R_JUMPER: Resistor; Part Description: 1A (0.05R Max DC Resistance) Zero Ohm Jumper; Manufacturer: GENERIC; Manufacturer1 Part Number: 232270591001L; PressFit: No; Part Number: R0402_0R_JUMPER; Component Kind: Standard; Component Type: Standard; Pin Count: 2; Value: 0; Status: Not Recommended; Manufacturer Part Number: R0402_0R_JUMPER; Case: 0402; Mounted: Yes; Sense: No; Socket: No; SMD: Yes; Manufacturer1 Example: YAGEO PHYCOMP; Manufacturer1 ComponentHeight: 0.4mm; HelpURL: \\cern.ch\dfs\Applications\Altium\Datasheets\R0402_Phycomp_RC0402.pdf; Author: CERN DEM JLC; CreateDate: 03.12.2007; LatestRevisionDate: 17.10.2012
R320 = R0402_4K7_1%_0.0625W_100PPM: Resistor - 1%; Manufacturer: GENERIC; Part Description: General Purpose Thick Film Chip Resistor; Manufacturer1 Part Number: 232270674702L; TC: ±100ppm/°C; PressFit: No; Manufacturer Part Number: R0402_4K7_1%_0.0625W_100PPM; Part Number: R0402_4K7_1%_0.0625W_100PPM; Tolerance: ±1%; Value: 4k7; Component Kind: Standard; Component Type: Standard; Pin Count: 2; Status: Not Recommended; Power: 0.0625W; Case: 0402; Mounted: Yes; Sense: No; Socket: No; SMD: Yes; Manufacturer1 Example: YAGEO PHYCOMP; Manufacturer1 ComponentHeight: 0.4mm; HelpURL: \\cern.ch\dfs\Applications\Altium\Datasheets\R0402_Phycomp_RC0402.pdf; Author: CERN DEM JLC; CreateDate: 03.12.2007; LatestRevisionDate: 17.10.2012
R321 R372 R377 R386 R399 R400 = R0402_200R_1%_0.0625W_100PPM: Resistor - 1%; Part Description: General Purpose Thick Film Chip Resistor; Manufacturer: GENERIC; Manufacturer1 Part Number: 232270672001L; TC: ±100ppm/°C; PressFit: No; Part Number: R0402_200R_1%_0.0625W_100PPM; Component Kind: Standard; Component Type: Standard; Pin Count: 2; Value: 200; Status: Not Recommended; Power: 0.0625W; Tolerance: ±1%; Manufacturer Part Number: R0402_200R_1%_0.0625W_100PPM; Case: 0402; Mounted: Yes; Sense: No; Socket: No; SMD: Yes; Manufacturer1 Example: YAGEO PHYCOMP; Manufacturer1 ComponentHeight: 0.4mm; HelpURL: \\cern.ch\dfs\Applications\Altium\Datasheets\R0402_Phycomp_RC0402.pdf; Author: CERN DEM JLC; CreateDate: 03.12.2007; LatestRevisionDate: 17.10.2012
R322 R325 R394 R395 = R0402_4K7_1%_0.0625W_100PPM: Resistor - 1%; Part Description: General Purpose Thick Film Chip Resistor; Manufacturer: GENERIC; Manufacturer1 Part Number: 232270674702L; TC: ±100ppm/°C; PressFit: No; Part Number: R0402_4K7_1%_0.0625W_100PPM; Component Kind: Standard; Component Type: Standard; Pin Count: 2; Value: 4k7; Status: Not Recommended; Power: 0.0625W; Tolerance: ±1%; Manufacturer Part Number: R0402_4K7_1%_0.0625W_100PPM; Case: 0402; Mounted: Yes; Sense: No; Socket: No; SMD: Yes; Manufacturer1 Example: YAGEO PHYCOMP; Manufacturer1 ComponentHeight: 0.4mm; HelpURL: \\cern.ch\dfs\Applications\Altium\Datasheets\R0402_Phycomp_RC0402.pdf; Author: CERN DEM JLC; CreateDate: 03.12.2007; LatestRevisionDate: 17.10.2012
R389 = R0402_0R_JUMPER: Resistor; Manufacturer: GENERIC; Part Description: 1A (0.05R Max DC Resistance) Zero Ohm Jumper; Manufacturer1 Part Number: 232270591001L; PressFit: No; Manufacturer Part Number: R0402_0R_JUMPER; Part Number: R0402_0R_JUMPER; Value: 0; Component Kind: Standard; Component Type: Standard; Pin Count: 2; Status: Not Recommended; Case: 0402; Mounted: Yes; Sense: No; Socket: No; SMD: Yes; Manufacturer1 Example: YAGEO PHYCOMP; Manufacturer1 ComponentHeight: 0.4mm; HelpURL: \\cern.ch\dfs\Applications\Altium\Datasheets\R0402_Phycomp_RC0402.pdf; Author: CERN DEM JLC; CreateDate: 03.12.2007; LatestRevisionDate: 17.10.2012
TP27 TP28 TP34 TP35 TP38-TP41 = SMD_PAD_1.27X1.27MM: Part Description: 1.27mm x 1.27mm PCB Copper Area (SMD Test Point); Mounted: No; Part Number: SMD_PAD_1.27X1.27MM; Component Kind: Standard (No BOM); Component Type: Standard (No BOM); Pin Count: 1; Family: Test Point; Socket: No; SMD: Yes; Sense: No; Status: None; ComponentHeight: 0mm; HelpURL: Undefined; Author: CERN DEM JLC; CreateDate: 12.01.2008; LatestRevisionDate: 12.01.2008; PackageDescription: 1.27mm x 1.27mm PCB Copper Area (SMD Test Point)